# Altium schematic sheet FrontIO.SchDoc
size A4; SheetNumber: 6; SheetTotal: 8
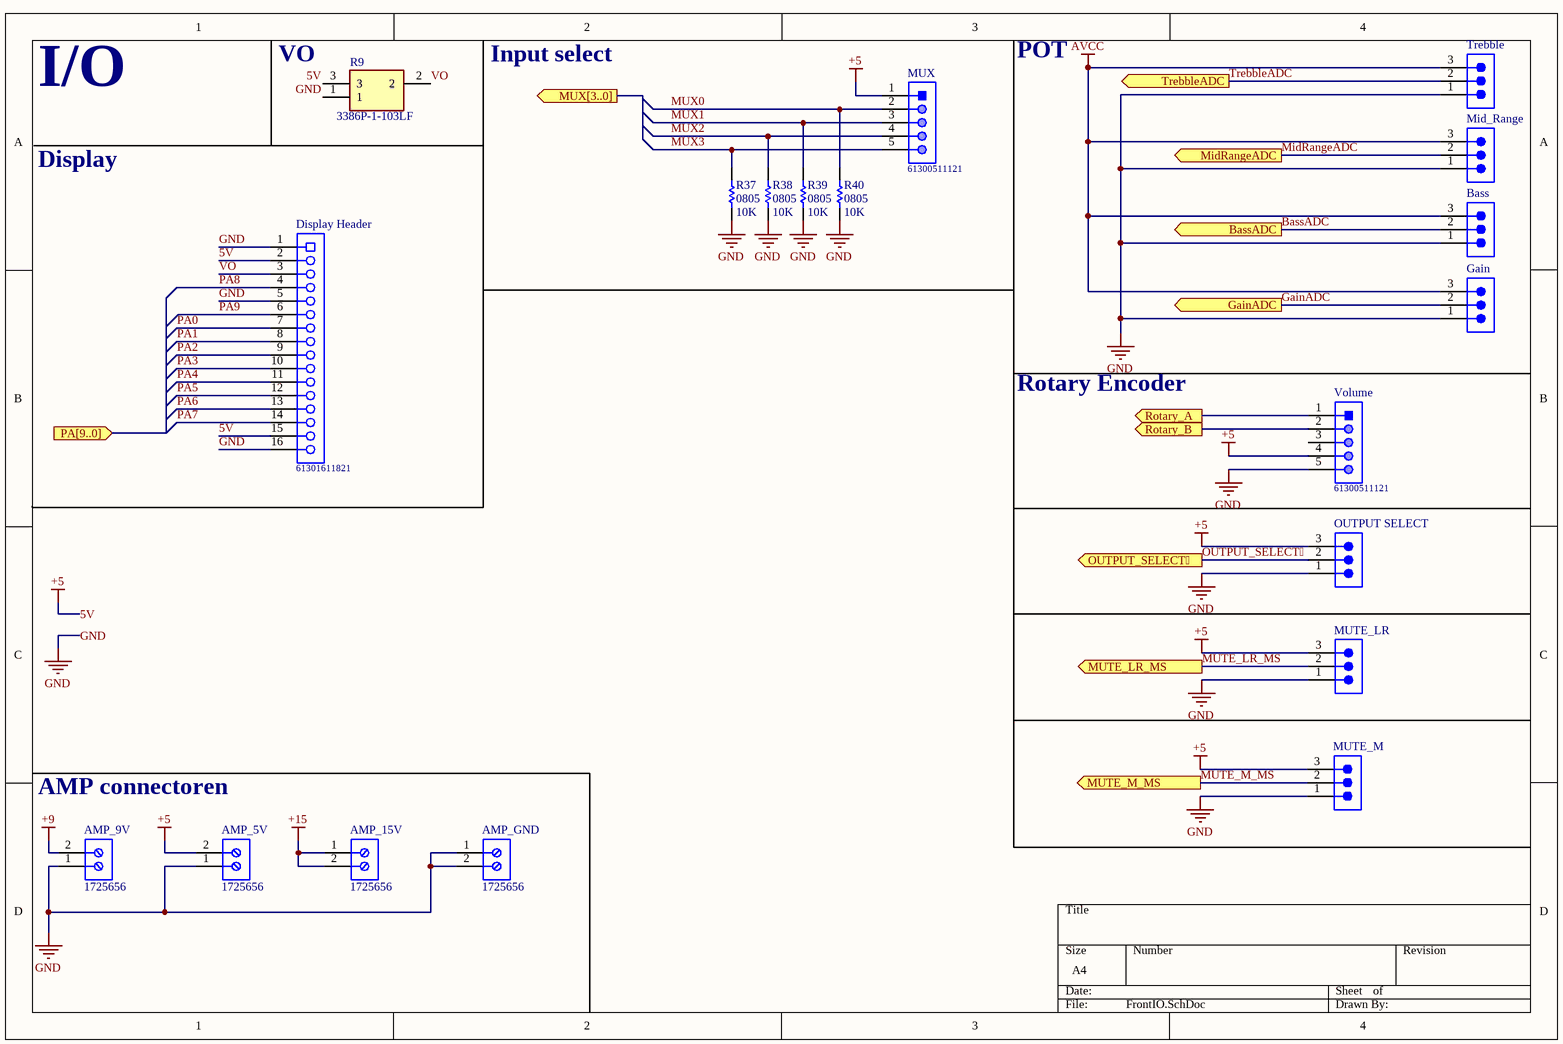
[diagram p0: FrontIO.SchDoc]

## Parts
AMP_5V  1725656  [PHOE-1725656-2]
AMP_9V  1725656  [PHOE-1725656-2]
AMP_15V  1725656  [PHOE-1725656-2]
AMP_GND  1725656  [PHOE-1725656-2]
Bass  TSW-103-07-F-S  [SMTC-TSW-103-07-X-S]  (value not drawn)
Display_Header  61301611821  [61301611821]
Gain  TSW-103-07-F-S  [SMTC-TSW-103-07-X-S]  (value not drawn)
Mid_Range  TSW-103-07-F-S  [SMTC-TSW-103-07-X-S]  (value not drawn)
MUTE_LR  TSW-103-07-F-S  [SMTC-TSW-103-07-X-S]  (value not drawn)
MUTE_M  TSW-103-07-F-S  [SMTC-TSW-103-07-X-S]  (value not drawn)
MUX  61300511121  [61300511121]
OUTPUT_SELECT  TSW-103-07-F-S  [SMTC-TSW-103-07-X-S]  (value not drawn)
R9  3386P-1-103LF  [3386P_1]
R37  0805  value 10K  [6-0805_N]
R38  0805  value 10K  [6-0805_N]
R39  0805  value 10K  [6-0805_N]
R40  0805  value 10K  [6-0805_N]
Trebble  TSW-103-07-F-S  [SMTC-TSW-103-07-X-S]  (value not drawn)
Volume  61300511121  [61300511121]

## Ports
BassADC (out, see Main[3C], ATtiny[3B]), GainADC (out, see Main[3C], ATtiny[3B]), MidRangeADC (out, see Main[3C], ATtiny[3B]), MUTE_LR_MS (out, see Main[4C], AnalogSwitch[3A]), MUTE_M_MS (out, see Main[4C], AnalogSwitch[3B]), MUX[3..0] (out, see Main[3C], ATtiny[1B]), OUTPUT_SELECT (out, see Main[3D], AnalogSwitch[1B]), PA[9..0] (in, see Main[3C], ATtiny[3C]), Rotary_A (out, see Main[3D], ATtiny[3B]), Rotary_B (out, see Main[3D], ATtiny[3B]), TrebbleADC (out, see Main[3C], ATtiny[3B])

## Nets
5V: AMP_5V.2 Display_Header.2 Display_Header.15 MUTE_LR.3 MUTE_M.3 MUX.1 OUTPUT_SELECT.3 R9.3 Volume.4  [also labelled +5]
+9: AMP_9V.2
+15: AMP_15V.1 AMP_15V.2
AVCC: Bass.3 Gain.3 Mid_Range.3 Trebble.3
GND: AMP_5V.1 AMP_9V.1 AMP_GND.1 AMP_GND.2 Bass.1 Display_Header.1 Display_Header.5 Display_Header.16 Gain.1 Mid_Range.1 MUTE_LR.1 MUTE_M.1 OUTPUT_SELECT.1 R9.1 R37.1 R38.1 R39.1 R40.1 Trebble.1 Volume.5
BassADC: Bass.2 ; port BassADC
GainADC: Gain.2 ; port GainADC
MidRangeADC: Mid_Range.2 ; port MidRangeADC
MUTE_LR_MS: MUTE_LR.2 ; port MUTE_LR_MS
MUTE_M_MS: MUTE_M.2 ; port MUTE_M_MS
MUX0: MUX.2 R40.2
MUX1: MUX.3 R39.2
MUX2: MUX.4 R38.2
MUX3: MUX.5 R37.2
OUTPUT_SELECT: OUTPUT_SELECT.2 ; port OUTPUT_SELECT
PA0: Display_Header.7
PA1: Display_Header.8
PA2: Display_Header.9
PA3: Display_Header.10
PA4: Display_Header.11
PA5: Display_Header.12
PA6: Display_Header.13
PA7: Display_Header.14
PA8: Display_Header.4
PA9: Display_Header.6
Rotary_A: Volume.1 ; port Rotary_A
Rotary_B: Volume.2 ; port Rotary_B
TrebbleADC: Trebble.2 ; port TrebbleADC
VO: Display_Header.3 R9.2

Not connected (* = marked no-connect by the designer): Volume 3

## Notes on the sheet
- I/O
- (near R9) VO
- Input select
- POT
- Display
- Rotary Encoder
- AMP connectoren

## Library data of the parts
AMP_5V AMP_9V AMP_15V AMP_GND = CMP-2000-05299-1: Male Header, Pitch 2.54 mm, 1 x 2 Position, Height 9 mm, Tail Length 3.5 mm; Manufacturer: Phoenix Contact; Number of contacts: 2; Content: 250pc(s); Pitch: 2.54mm; Industrial packaging: Yes; Colour: Green; Manufacturer part No.: 1725656; Type: MPT0,5/2-2,54; Datasheet URL: http://datasheet.octopart.com/1725656-Phoenix-Contact-datasheet-5302866.pdf; Manufacturer URL: http://www.phoenixcontact.com/; Datasheet Version: Apr-08
Bass Gain Mid_Range MUTE_LR MUTE_M OUTPUT_SELECT Trebble = CMP-1024-00331-1: 0.025" SQ Post Header, Through-hole, Vertical, -55 to 125 degC, 2.54 mm Pitch, 3-Pin, Male, RoHS; Manufacturer: Samtec; Pitch: 2.54 mm; DatasheetVersion: F-214; ComponentLink1Description: Manufacturer URL; ComponentLink3URL: http://www.samtec.com/documents/webfiles/cpdf/TSW-XXX-XX-XXX-X-XX-XXX-MKT.pdf; Mounting Technology: Through-hole; PackageDescription: .025[0.64] SQ. Post Terminal Strip Assembly; Temperature Range: -55 to 125 degC; ComponentLink3Description: Package Specification; Orientation: Vertical; PartNumber: TSW-103-07-F-S; RoHS: True; PackageVersion: DM, 8/1988; ComponentLink2Description: Datasheet; ComponentLink1URL: http://www.samtec.com; ComponentLink2URL: http://www.samtec.com/documents/webfiles/pdf/TSW_TH.PDF; PackageReference: TSW-103-07-X-S
Display_Header = CMP-1502-01343-1: THT Vertical Socket Header WR-PHD, Pitch 2.54 mm, Single Row, 16 pins; Manufacturer: Wurth Elektronik; Working Voltage: 250VAC; Pin Number: 16; Gender: Female; Withstanding Voltage: 500VAC; Rated Current: 3A; Contact Resistance: 20mOhm; Pitch: 2.54mm; Operating Temperature: -40to125degC; Manufacturer URL: http://www.we-online.de; Mounting Technology: THT; Part Number: 61301611821; Datasheet URL: https://katalog.we-online.de/em/datasheet/6130xx11821.pdf; Publisher: WurthElektronik; Row Number: Single; Orientation: Vertical; Packaging: Tray; Package Reference: 61301611821
MUX Volume = CMP-1502-01068-1: THT Vertical Pin Header WR-PHD, Pitch 2.54 mm, Single Row, 5 pins; Manufacturer: Wurth Elektronik; Pin Number: 5; Contact Resistance: 20mOhm; Working Voltage: 250VAC; Pitch: 2.54mm; Withstanding Voltage: 500VAC; Rated Current: 3A; Gender: Male; Datasheet URL: https://katalog.we-online.de/em/datasheet/6130xx11121.pdf; Orientation: Vertical; Mounting Technology: THT; Row Number: Single; Package Reference: 61300511121; Publisher: WurthElektronik; Part Number: 61300511121; Packaging: Bag; Manufacturer URL: http://www.we-online.de; Operating Temperature: -40to105degC
R9 = 3386P-1-103LF: Resistor; Manufacturer_Name: Bourns; Datasheet Link: https://www.bourns.com/pdfs/3386.pdf; Manufacturer_Part_Number: 3386P-1-103LF; Mouser Part Number: 652-3386P-1-103LF; Mouser Price/Stock: https://www.mouser.co.uk/ProductDetail/Bourns/3386P-1-103LF?qs=m2uG%2FFdTAPWTJ6kNGJOVuA%3D%3D; Arrow Part Number: 3386P-1-103LF; Arrow Price/Stock: https://www.arrow.com/en/products/3386p-1-103lf/bourns?region=europe
R37-R40 = Res1: Resistor; Published: 8-Jun-2000; LatestRevisionDate: 17-Jul-2002; LatestRevisionNote: Re-released for DXP Platform.; PackageReference: AXIAL-0.3; Publisher: Altium Limited; PackageDescription: Axial Device, Thru-Hole; 2 Leads; 0.3 in Pin Spacing